# EAGLE design xbee_pc (EAGLE 5.07)
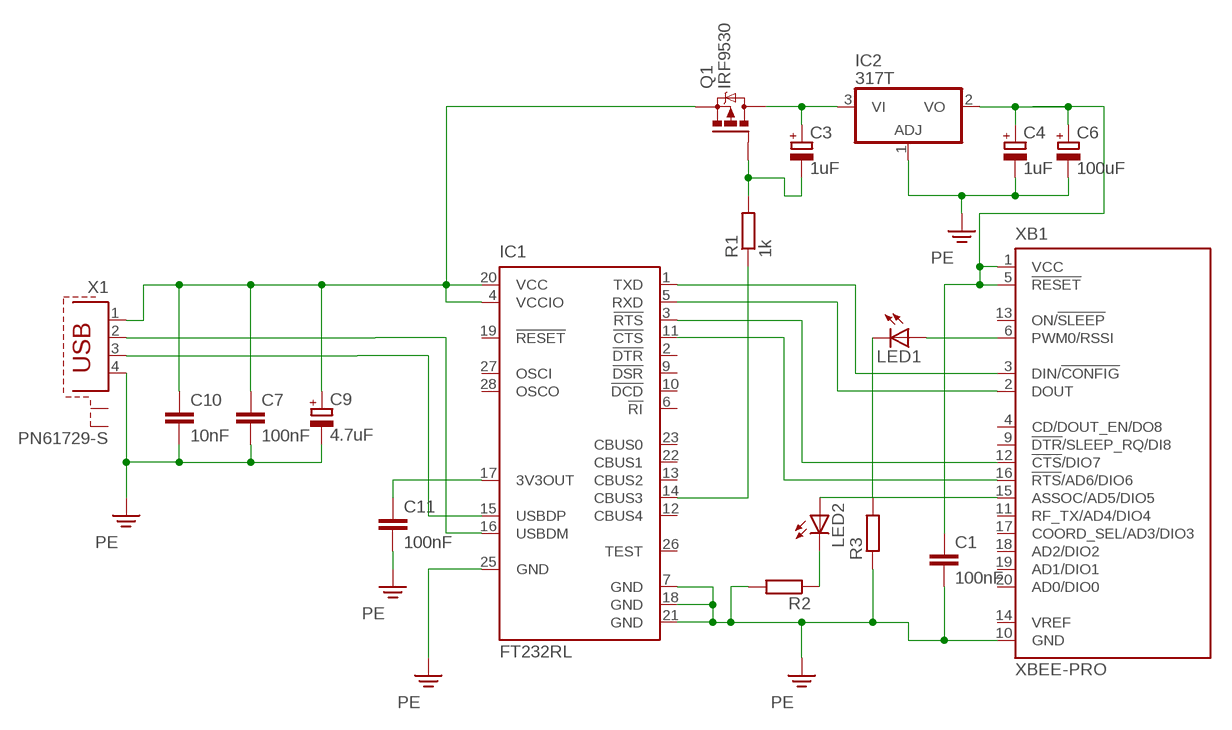
[diagram p0: schematic, sheet 1]

## Parts
C1  100nF  C-EU050-024X044  [C050-024X044]
C3  1uF  CPOL-EUE15-5AXIAL  [E15-5]
C4  1uF  CPOL-EUE15-5AXIAL  [E15-5]
C6  100uF  CPOL-EUE15-5AXIAL  [E15-5]
C7  100nF  C-EU050-024X044  [C050-024X044]
C9  4.7uF  CPOL-EUE15-5AXIAL  [E15-5]
C10  10nF  C-EU050-024X044  [C050-024X044]
C11  100nF  C-EU050-024X044  [C050-024X044]
IC1  FT232RL  [SSOP28]
IC2  317T  [TO220H]
LED1  LED3MM  [LED3MM]
LED2  LED3MM  [LED3MM]
Q1  IRF9530  [TO220BV]
R1  1k  R-EU_0207/10  [0207/10]
R2  R-EU_0207/10  [0207/10]
R3  R-EU_0207/10  [0207/10]
X1  PN61729-S  [PN61729-S]
XB1  XBEE-PRO  [XBEE-PRO]

## Nets
N$1: IC1.1(TXD) XB1.3(DIN/!CONFIG)
N$2: IC1.3(!RTS) XB1.12(!CTS!/DIO7)
N$3: IC1.11(!CTS) XB1.16(!RTS!/AD6/DIO6)
N$4: IC1.14(CBUS3) R1.1
N$5: C3.- Q1.G R1.2
N$6: IC1.5(RXD) XB1.2(DOUT)
N$7: C11.1 IC1.17(3V3OUT)
N$8: IC1.16(USBDM) X1.2
N$9: C7.1 C9.+ C10.1 IC1.4(VCCIO) IC1.20(VCC) Q1.S X1.1
N$10: C1.1 C4.+ C6.+ IC2.2(VO) XB1.1(VCC) XB1.5(!RESET)
N$11: IC1.15(USBDP) X1.3
N$12: LED1.K(C) R3.2
N$13: LED1.A XB1.6(PWM0/RSSI)
N$14: LED2.A XB1.15(ASSOC/AD5/DIO5)
N$15: LED2.K(C) R2.1
N$16: C3.+ IC2.3(VI) Q1.D
PE: C1.2 C4.- C6.- C7.2 C9.- C10.2 C11.2 IC1.7(GND) IC1.18(GND) IC1.21(GND) IC1.25(GND) IC2.1(ADJ) R2.2 R3.1 X1.4 XB1.10(GND)
Unconnected: IC1.2(!DTR) IC1.6(!RI) IC1.9(!DSR) IC1.10(!DCD) IC1.12(CBUS4) IC1.13(CBUS2) IC1.19(!RESET) IC1.22(CBUS1) IC1.23(CBUS0) IC1.26(TEST) IC1.27(OSCI) IC1.28(OSCO) X1.S1 X1.S2 XB1.4(CD/DOUT_EN/DO8) XB1.9(!DTR!/SLEEP_RQ/DI8) XB1.11(RF_TX/AD4/DIO4) XB1.13(ON/!SLEEP) XB1.14(VREF) XB1.17(COORD_SEL/AD3/DIO3) XB1.18(AD2/DIO2) XB1.19(AD1/DIO1) XB1.20(AD0/DIO0)

## Library data of the parts
C1 C7 C10 C11 = rcl:C-EU: CAPACITOR, European symbol
C3 C4 C6 C9 = rcl:CPOL-EU: POLARIZED CAPACITOR, European symbol
IC1 = ftdichip:FT232R: Source: http://www.ftdichip.com/Documents/DataSheets/DS_FT232R_v104.pdf
IC2 = linear:*317: Positive VOLTAGE REGULATOR
LED1 LED2 = led:LED: LED OSRAM: - CHIPLED LG R971, LG N971, LY N971, LG Q971, LY Q971, LO R971, LY R971 LH N974, LH R974 LS Q976, LO Q976, LY Q976 LO Q996 - Hyper CHIPLED LW Q18S LB Q993, LB Q99A, LB R99A - SideLED LS A670, LO A670, LY A670, LG A670, LP A670 LB A673, LV A673, LT A673, LW A673 LH A674 LY A675 LS A676, LA A676, LO A676, LY A676, LW A676 LS A679, LY A679, LG A679 - Hyper Micro SIDELED® LS Y876, LA Y876, LO Y876, LY Y876 LT Y87S - SmartLED LW L88C, LW L88S LB L89C, LB L89S, LG L890 LS L89K, LO L89K, LY L89K LS L896, LA L896, LO L896, LY L896 - TOPLED LS T670, LO T670, LY T670, LG T670, LP T670 LSG T670, LSP T670, LSY T670, LOP T670, LYG T670 LG T671, LOG T671, LSG T671 LB T673, LV T673, LT T673, LW T673 LH T674 LS T676, LA T676, LO T676, LY T676, LB T676, LH T676, LSB T676, LW T676 LB T67C, LV T67C, LT T67C, LS T67K, LO T67K, LY T67K, LW E67C LS E67B, LA E67B, LO E67B, LY E67B, LB E67C, LV E67C, LT E67C LW T67C LS T679, LY T679, LG T679 LS T770, LO T770, LY T770, LG T770, LP T770 LB T773, LV T773, LT T773, LW T773 LH T774 LS E675, LA E675, LY E675, LS T675 LS T776, LA T776, LO T776, LY T776, LB T776 LHGB T686 LT T68C, LB T68C - Hyper Mini TOPLED® LB M676 - Mini TOPLED Santana® LG M470 LS M47K, LO M47K, LY M47K Source: http://www.osram.convergy.de LUXEON: - LUMILED® LXK2-PW12-R00, LXK2-PW12-S00, LXK2-PW14-U00, LXK2-PW14-V00 LXK2-PM12-R00, LXK2-PM12-S00, LXK2-PM14-U00 LXK2-PE12-Q00, LXK2-PE12-R00, LXK2-PE12-S00, LXK2-PE14-T00, LXK2-PE14-U00 LXK2-PB12-K00, LXK2-PB12-L00, LXK2-PB12-M00, LXK2-PB14-N00, LXK2-PB14-P00, LXK2-PB14-Q00 LXK2-PR12-L00, LXK2-PR12-M00, LXK2-PR14-Q00, LXK2-PR14-R00 LXK2-PD12-Q00, LXK2-PD12-R00, LXK2-PD12-S00 LXK2-PH12-R00, LXK2-PH12-S00 LXK2-PL12-P00, LXK2-PL12-Q00, LXK2-PL12-R00 Source: www.luxeon.com KINGBRIGHT: KA-3528ASYC Source: www.kingbright.com
Q1 = transistor-power:IRF9530: P-CHANNEL HEXFET POWER-MOS-FET Source: http://www.irf.com/product-info/datasheets/data/irf9530.pdf
R1 = resistor:R-EU_: RESISTOR, European symbol
R2 R3 = rcl:R-EU_: RESISTOR, European symbol
X1 = con-berg:PN61729-S: BERG USB connector
XB1 = maxstream:XBEE: XBee (TM) /XBee-PRO(TM) OEM RF Modules Source: MaxStream, Inc. xbee_productmanual.pdf

## Board
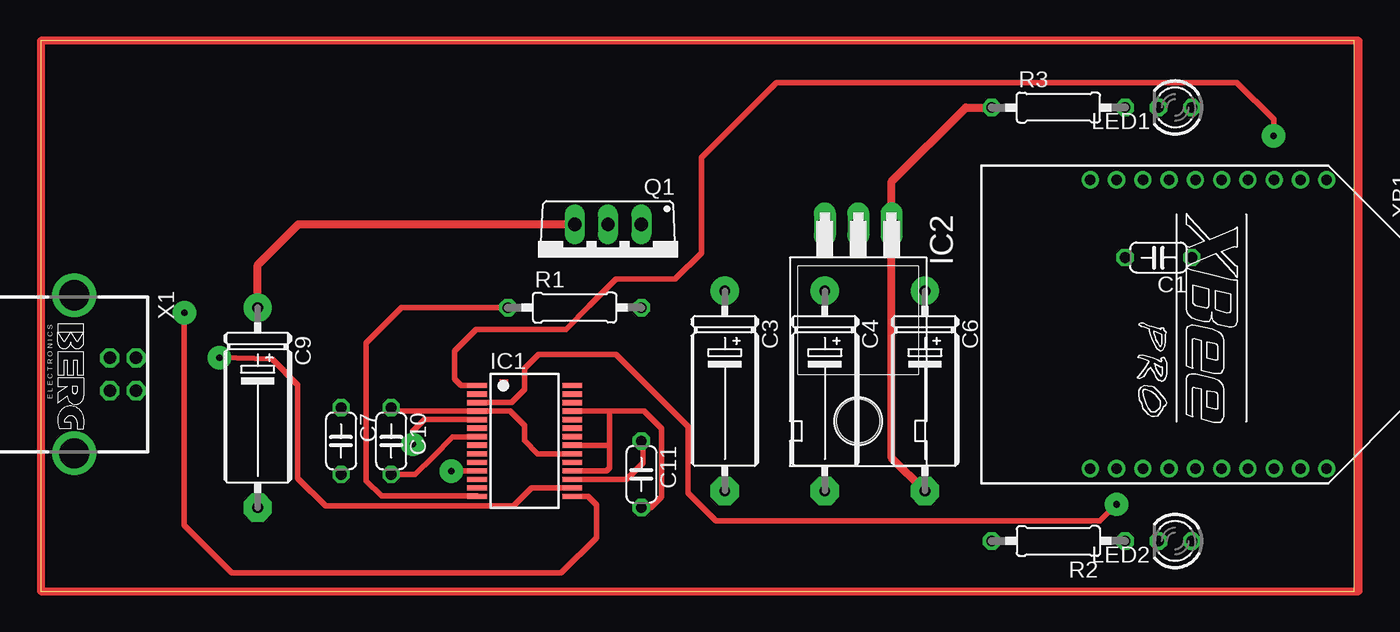
[diagram p1: board, top side]
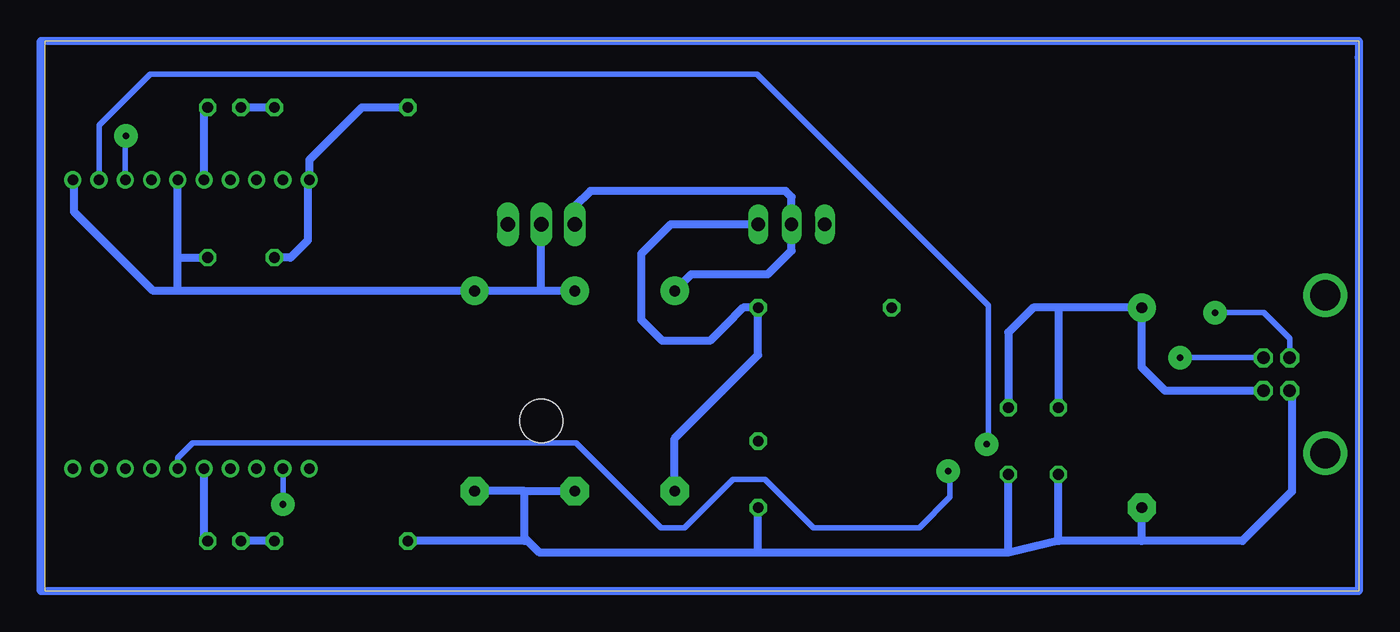
[diagram p2: board, bottom side, seen from below]

Size 100 x 41.9 mm. Coordinates in mm from the lower left corner, seen from the top.
Outline: 0,0 100,0 100,41.9 0,41.9 0,0
Copper layers (1*16): Top 0.035mm / dielectric 1.5mm / Bottom 0.035mm
Design rules "default": minimum track width 10mil, minimum drill 24mil, track to track 8mil, track to pad 8mil, pad to pad 8mil, via to via 8mil, smd to smd 8mil, copper to edge 40mil, drill to drill 8mil, minimum pad ring 10mil, minimum via ring 8mil, stop-mask expansion 4mil, vias tented up to drill 0mil, thermal gap 10mil

### Footprints (pad centres in the part's own frame; a part is rotated, then mirrored left to right if it is on the bottom)
C050-024X044 = drill 0.813 octagon: 1 -2.54,0; 2 2.54,0
E15-5 = drill 0.813 pad 2.159 round: + -7.62,0 | drill 0.813 pad 2.159 octagon: - 7.62,0
SSOP28 = smd 0.4 x 1.5: 1 -4.225,-3.625; 2 -3.575,-3.625; 3 -2.925,-3.625; 4 -2.275,-3.625; 5 -1.625,-3.625; 6 -0.975,-3.625; 7 -0.325,-3.625; 8 0.325,-3.625; 9 0.975,-3.625; 10 1.625,-3.625; 11 2.275,-3.625; 12 2.925,-3.625; 13 3.575,-3.625; 14 4.225,-3.625; 15 4.225,3.625; 16 3.575,3.625; 17 2.925,3.625; 18 2.275,3.625; 19 1.625,3.625; 20 0.975,3.625; 21 0.325,3.625; 22 -0.325,3.625; 23 -0.975,3.625; 24 -1.625,3.625; 25 -2.275,3.625; 26 -2.925,3.625; 27 -3.575,3.625; 28 -4.225,3.625
TO220H = drill 1.118 long: 1 -2.54,-10.16; 2 0,-10.16; 3 2.54,-10.16 | hole 3.302: 0,4.826
LED3MM = drill 0.813 octagon: A -1.27,0; K 1.27,0
TO220BV = drill 1.016 long: D 0,-2.54; G -2.54,-2.54; S 2.54,-2.54
0207/10 = drill 0.813 octagon: 1 -5.08,0; 2 5.08,0
PN61729-S = drill 0.95 octagon: 1 1.25,4.71; 2 -1.25,4.71; 3 -1.25,2.71; 4 1.25,2.71 | drill 2.3 pad 2.9 round: S1 -6.02,0; S2 6.02,0
XBEE-PRO = drill 0.8 pad 1.27 round: 1 -11,9; 2 -11,7; 3 -11,5; 4 -11,3; 5 -11,1; 6 -11,-1; 7 -11,-3; 8 -11,-5; 9 -11,-7; 10 -11,-9; 11 11,-9; 12 11,-7; 13 11,-5; 14 11,-3; 15 11,-1; 16 11,1; 17 11,3; 18 11,5; 19 11,7; 20 11,9

### Placement (x,y rotation side)
C1  85.09,25.4 180 top
C3  52.07,15.24 270 top
C4  59.69,15.24 270 top
C6  67.31,15.24 270 top
C7  22.86,11.43 270 top
C9  16.51,13.97 270 top
C10  26.67,11.43 270 top
C11  45.72,8.89 270 top
IC1  36.83,11.43 270 top
IC2  62.23,17.78 180 top
LED1  86.36,36.83 180 top
LED2  86.36,3.81 180 top
Q1  43.18,25.4 180 top
R1  40.64,21.59 0 top
R2  77.47,3.81 180 top
R3  77.47,36.83 0 top
X1  2.54,16.51 270 top
XB1  88.9,20.32 270 top

### Tracks (layer width: path | path; a pad name or v marks a point on that pad's centre or on a via)
N$1  (via drill 0.5 pad 1.78)
  Top 0.406: IC1.1 32.01,15.65 31.5,16.17 31.5,18.28 33.15,19.94 39.99,19.94 41.78,21.73 43.8,23.75 48.28,23.75 50.29,25.76 50.29,33.02 56.01,38.73 91.06,38.73 93.85,35.95 v93.85,34.67
  Bottom 0.406: v93.85,34.67 93.9,34.67 XB1.3
N$2  (via drill 0.5 pad 1.78)
  Top 0.406: IC1.3 35.84,14.36 36.83,15.34 36.83,16.96 37.91,18.03 43.78,18.03 49.28,12.54 49.28,7.46 51.41,5.33 80.64,5.33 v81.92,6.6
  Bottom 0.406: v81.92,6.6 81.9,6.6 XB1.12
N$3  (via drill 0.5 pad 1.78)
  Top 0.406: IC1.11 31.24,9.15 v31.24,9.14
  Bottom 0.406: v31.24,9.14 31.11,9.14 31.11,7.16 33.45,4.83 41.52,4.83 43.94,7.25 45.2,8.51 47.62,8.51 49.28,6.86 51.31,4.83 53.11,4.83 56.26,7.98 59.59,11.3 88.76,11.3 89.9,10.16 XB1.16
N$4
  Top 0.406: R1.1 27.46,21.59 24.77,18.9 24.77,8.41 25.94,7.24 33.2,7.24 IC1.14
N$5
  Bottom 0.61: C3.- 52.07,11.63 48.46,15.24 45.72,17.98 R1.2 46.86,21.59 48.26,20.19 49.4,19.05 53,19.05 54.61,20.66 54.61,25.69 52.36,27.94 Q1.G
N$6  (via drill 0.5 pad 1.78)
  Top 0.406: v28.32,11.18 28.32,12.15 29.22,13.05 IC1.5
  Bottom 0.406: v28.32,11.18 28.19,11.18 28.19,21.77 45.8,39.37 92,39.37 95.9,35.47 XB1.2
N$7
  Top 0.406: C11.1 45.85,11.43 45.85,9.78 44.58,8.51 IC1.17
N$8  (via drill 0.5 pad 1.78)
  Top 0.406: IC1.16 37.35,7.86 36.96,7.46 35.98,6.48 21.67,6.48 19.56,8.59 19.56,15.71 17.61,17.69 v13.59,17.78
  Bottom 0.406: v13.59,17.78 7.25,17.78 X1.2
N$9
  Top 0.406: C10.1 26.67,13.71 IC1.4 35.74,13.72 36.83,12.62 36.83,11.46 37.83,10.46 IC1.20
  Top 0.61: C9.+ 16.51,24.84 19.61,27.94 Q1.S
  Bottom 0.61: 22.86,21.59 C9.+ 16.51,17.05 14.72,15.26 X1.1 | 22.86,21.59 C7.1 | 22.86,21.59 24.78,21.59 26.67,19.7 C10.1
N$10
  Bottom 0.61: 89.9,25.4 C1.1 | 89.9,25.4 XB1.5 | 62.23,22.86 IC2.2 | C4.+ 62.23,22.86 | 62.23,22.86 C6.+ 89.9,22.86 | 89.9,22.86 89.9,25.4 | XB1.1 97.79,31.32 97.79,28.88 91.77,22.86 89.9,22.86
N$11  (via drill 0.5 pad 1.78)
  Top 0.406: IC1.15 41.65,7.21 42.29,6.56 42.29,4.07 39.62,1.4 14.52,1.4 10.92,4.99 v10.92,21.21
  Bottom 0.406: v10.92,21.21 7.22,21.21 5.25,19.24 X1.3
N$12
  Bottom 0.61: R3.2 LED1.K
N$13
  Bottom 0.61: LED1.A 87.9,36.83 XB1.6
N$14
  Bottom 0.61: LED2.A 87.9,3.81 XB1.15
N$15
  Bottom 0.61: R2.1 LED2.K
N$16
  Bottom 0.61: C3.+ 50.8,24.13 44.98,24.13 43.18,25.93 Q1.D 43.18,30.02 43.64,30.48 58.49,30.48 59.69,29.28 IC2.3
N$17
  Bottom 0.61: 0,41.91 0,40.64 | 0,40.64 0,0 100.33,0 100.33,41.91 0,41.91 | 0,41.91 0,40.64
N$18
  Top 0.61: 0,41.91 0,0 100.33,0 100.33,41.91 0,41.91
PE
  Top 0.406: 43.31,11.11 IC1.21 | 43.31,13.59 43.31,11.11 | 43.31,13.72 43.31,13.59 | 43.31,13.72 IC1.25 | 43.31,11.11 43.31,9.4 43.05,9.14 IC1.18 | IC1.7 31.36,11.76 29.84,10.24 28.5,8.89 C10.2 | C11.2 46.43,6.35 47.24,7.16 47.24,12.39 45.92,13.72 43.31,13.72 | 43.31,13.72 43.31,13.59
  Top 0.61: C6.- 64.77,10.16 IC2.1 64.77,31.17 70.43,36.83 R3.1
  Bottom 0.61: X1.4 5.08,15.26 5.08,7.59 8.86,3.81 16.51,3.81 | 22.86,3.81 26.67,2.92 | 22.86,3.81 C7.2 | 26.67,2.92 C10.2 | 26.67,2.92 45.72,2.92 | 45.72,2.92 C11.2 45.72,2.92 | 16.51,3.81 22.86,3.81 | 16.51,3.81 C9.- | C1.2 81.32,25.4 80.01,26.71 80.01,31.32 XB1.10 79.9,32.84 75.91,36.83 R3.1 | 63.5,7.62 C4.- | 63.5,7.62 C6.- | R2.2 63.5,3.81 63.5,4.06 | 63.5,4.06 63.5,7.62 | 45.72,2.92 62.36,2.92 63.5,4.06
(copper drawn outside any net)
  shapes: Top area x1